# EAGLE schematic ml-rf (EAGLE 5.06)
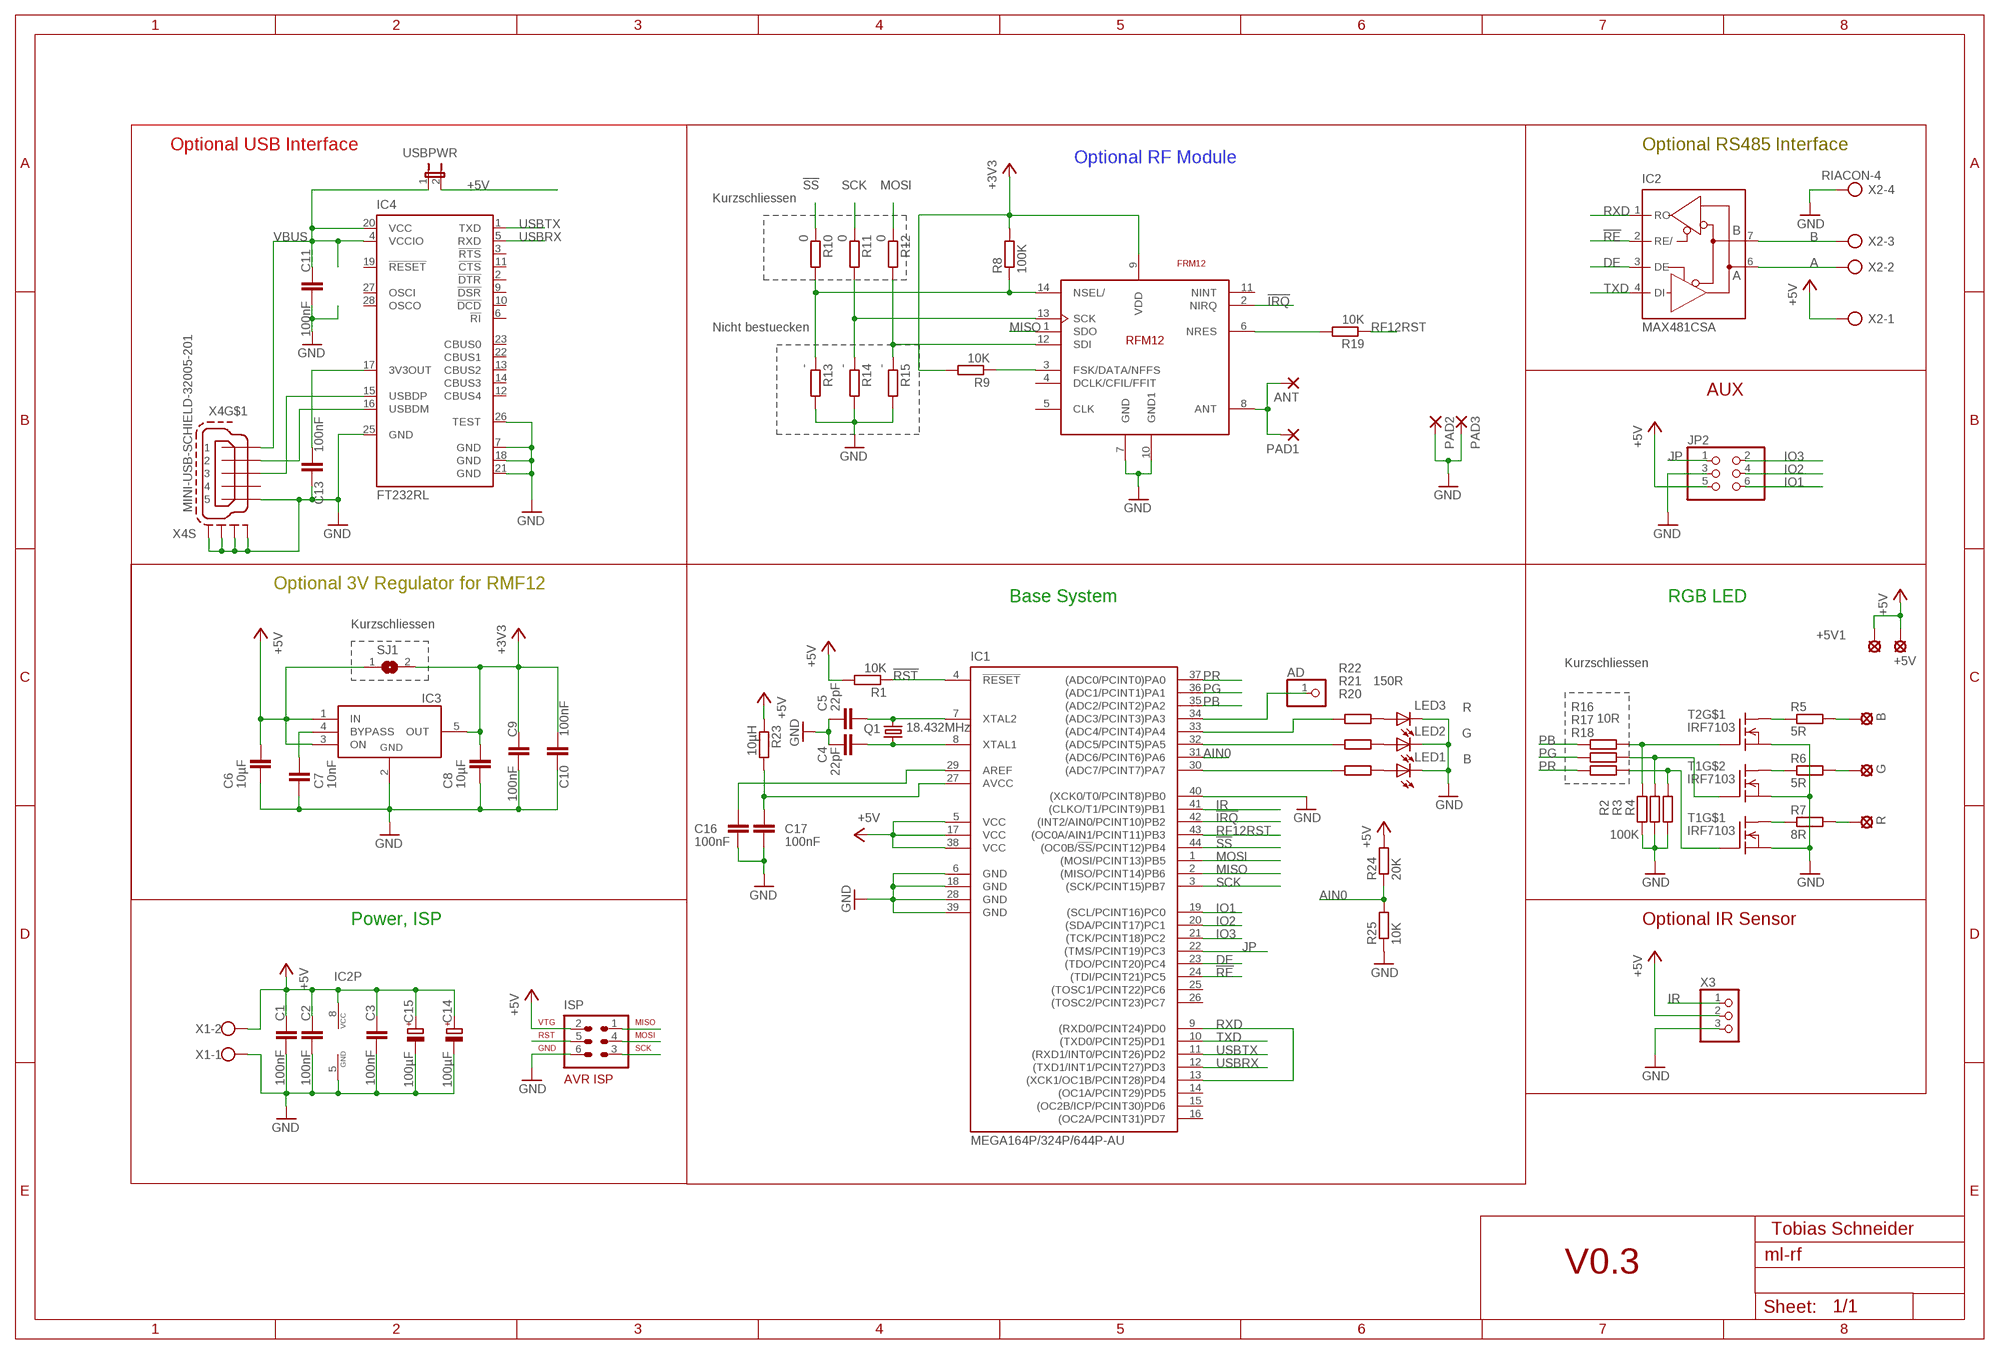
[diagram p0: schematic, sheet 1]

## Parts
+5V  SE14  [SE14]
+5V1  SE14  [SE14]
AD  PINHD-1X1  [1X01]
ANT  2,15/1,0  [2,15/1,0]
B  SE14  [SE14]
C1  100nF  C-EUC0805K  [C0805K]
C2  100nF  C-EUC0805K  [C0805K]
C3  100nF  C-EUC0805K  [C0805K]
C4  22pF  C-EUC0805K  [C0805K]
C5  22pF  C-EUC0805K  [C0805K]
C6  10µF  C-EUC0805K  [C0805K]
C7  10nF  C-EUC0805K  [C0805K]
C8  10µF  C-EUC0805K  [C0805K]
C9  100nF  C-EUC0805K  [C0805K]
C10  100nF  C-EUC0805K  [C0805K]
C11  100nF  C-EUC0805K  [C0805K]
C13  100nF  C-EUC0805K  [C0805K]
C14  100µF  CPOL-EUE2.5-6  [E2,5-6]
C15  100µF  CPOL-EUE2.5-6  [E2,5-6]
C16  100nF  C-EUC0603  [C0603]
C17  100nF  C-EUC0603  [C0603]
G  SE14  [SE14]
IC1  MEGA164P/324P/644P-AU  [TQFP44]
IC2  MAX481CSA  [SO08]
IC3  LP2992-3.3  [SOT-23-5]
IC4  FT232RL  [SSOP28]
ISP  AVR-ISP-6  [AVR-ISP-6]
JP2  PINHD-2X3  [2X03]
LED1  B  LEDCHIP-LED0603  [CHIP-LED0603]
LED2  G  LEDCHIP-LED0603  [CHIP-LED0603]
LED3  R  LEDCHIP-LED0603  [CHIP-LED0603]
PAD1  SMD2  [SMD1,27-2,54]
PAD2  SMD2  [SMD1,27-2,54]
PAD3  SMD2  [SMD1,27-2,54]
Q1  18.432MHz  CRYTALHC49UP  [HC49UP@1]
R  SE14  [SE14]
R1  10K  R-EU_M0805  [M0805]
R2  100K  R-EU_M0805  [M0805]
R3  100K  R-EU_M0805  [M0805]
R4  100K  R-EU_M0805  [M0805]
R5  5R  R-EU_0414/15  [0414/15]
R6  5R  R-EU_0414/15  [0414/15]
R7  8R  R-EU_0414/15  [0414/15]
R8  100K  R-EU_M0805  [M0805]
R9  10K  R-EU_M0805  [M0805]
R10  0  R-EU_M0805  [M0805]
R11  0  R-EU_M0805  [M0805]
R12  0  R-EU_M0805  [M0805]
R13  -  R-EU_M0805  [M0805]
R14  -  R-EU_M0805  [M0805]
R15  -  R-EU_M0805  [M0805]
R16  10R  R-EU_M0805  [M0805]
R17  10R  R-EU_M0805  [M0805]
R18  10R  R-EU_M0805  [M0805]
R19  10K  R-EU_M0805  [M0805]
R20  150R  R-EU_R0603  [R0603]
R21  150R  R-EU_R0603  [R0603]
R22  150R  R-EU_R0603  [R0603]
R23  10µH  R-EU_R0805  [R0805]
R24  20K  R-EU_R0603  [R0603]
R25  10K  R-EU_R0603  [R0603]
RFM12  FRM12  [RFM12]
SJ1  SJ  [SJ]
T1  IRF7103  [SO-8]
T2  IRF7103  [SO-8]
USBPWR  JP1E  [JP1]
X1  W237-102-350  [W237-102-3.5-1.2]
X2  RIACON-4  [RIACON-4]
X3  PINHD-1X3SMALL  [1X03-SMALL]
X4  MINI-USB-SCHIELD-32005-201  [32005-201]

## Nets
!IRQ: IC1.42((INT2/AIN0/PCINT10)PB2) RFM12.2(NIRQ)
!RE: IC1.24((TDI/PCINT21)PC5) IC2.2(RE/)
!RST: IC1.4(!RESET) ISP.5 R1.1
!SS: IC1.44((OC0B/!SS!/PCINT12)PB4) R10.1
+3V3: C8.1 C9.1 C10.2 IC3.5(OUT) R8.2 R9.2 RFM12.9(VDD) SJ1.2
+5V: +5V1.MP +5V.MP C1.1 C2.1 C3.1 C6.1 C14.+ C15.+ IC1.5(VCC) IC1.17(VCC) IC1.38(VCC) IC2.8(VCC) IC3.1(IN) IC3.3(ON) ISP.2 JP2.5 R1.2 R23.1 R24.2 SJ1.1 USBPWR.2 X1.2 X2.1 X3.2
A: IC2.6(A) X2.2
AIN0: IC1.31((ADC6/PCINT6)PA6) R24.1 R25.2
B: IC2.7(B) X2.3
BY: C7.1 IC3.4(BYPASS)
DE: IC1.23((TDO/PCINT20)PC4) IC2.3(DE)
GB: R2.1 R16.1 T2.2(G)
GG: R3.1 R17.1 T1.4(G)
GND: C1.2 C2.2 C3.2 C4.1 C5.1 C6.2 C7.2 C8.2 C9.2 C10.1 C11.2 C13.1 C14.- C15.- C16.1 C17.1 IC1.6(GND) IC1.18(GND) IC1.28(GND) IC1.39(GND) IC1.40((XCK0/T0/PCINT8)PB0) IC2.5(GND) IC3.2(GND) IC4.7(GND) IC4.18(GND) IC4.21(GND) IC4.25(GND) IC4.26(TEST) ISP.6 JP2.3 LED1.C LED2.C LED3.C PAD2.1(P) PAD3.1(P) R2.2 R3.2 R4.2 R13.2 R14.2 R15.2 R25.1 RFM12.7(GND) RFM12.10(GND1) T1.1(S) T1.3(S) T2.1(S) X1.1 X2.4 X3.3 X4.5 X4.M1(S:S1) X4.M2(S:S2) X4.M3(S:S3) X4.M4(S:S4)
GR: R4.1 R18.1 T1.2(G)
IO1: IC1.19((SCL/PCINT16)PC0) JP2.6
IO2: IC1.20((SDA/PCINT17)PC1) JP2.4
IO3: IC1.21((TCK/PCINT18)PC2) JP2.2
IR: IC1.41((CLKO/T1/PCINT9)PB1) X3.1
JP: IC1.22((TMS/PCINT19)PC3) JP2.1
LO1: IC1.30((ADC7/PCINT7)PA7) R20.2
LO2: IC1.32((ADC5/PCINT5)PA5) R21.2
LO3: IC1.33((ADC4/PCINT4)PA4) R22.2
MISO: IC1.2((MISO/PCINT14)PB6) ISP.1 RFM12.1(SDO)
MOSI: IC1.1((MOSI/PCINT13)PB5) ISP.4 R12.1
N$1: R7.1 T1.8(D1)
N$3: R11.2 R14.1 RFM12.13(SCK)
N$4: R6.1 T1.5(D1)
N$5: R5.1 T2.8(D1)
N$6: R12.2 R15.1 RFM12.12(SDI)
N$7: R7.2 R.MP
N$8: G.MP R6.2
N$9: B.MP R5.2
N$10: IC4.16(USBDM) X4.2
N$11: R9.1 RFM12.3(FSK/DATA/NFFS)
N$12: R19.2 RFM12.6(NRES)
N$13: ANT.1(P) PAD1.1(P) RFM12.8(ANT)
N$14: R8.1 R10.2 R13.1 RFM12.14(NSEL/)
N$15: C17.2 IC1.27(AVCC) R23.2
N$16: IC4.15(USBDP) X4.3
N$20: C13.2 IC4.17(3V3OUT)
N$21: LED1.A R20.1
N$22: LED2.A R21.1
N$23: LED3.A R22.1
N$27: AD.1 IC1.34((ADC3/PCINT3)PA3)
N$29: C16.2 IC1.29(AREF)
PB: IC1.35((ADC2/PCINT2)PA2) R16.2
PG: IC1.36((ADC1/PCINT1)PA1) R17.2
PR: IC1.37((ADC0/PCINT0)PA0) R18.2
RF12RST: IC1.43((OC0A/AIN1/PCINT11)PB3) R19.1
RXD: IC1.9((RXD0/PCINT24)PD0) IC1.13((XCK1/OC1B/PCINT28)PD4) IC2.1(RO)
SCK: IC1.3((SCK/PCINT15)PB7) ISP.3 R11.1
TXD: IC1.10((TXD0/PCINT25)PD1) IC2.4(DI)
USBRX: IC1.12((TXD1/INT1/PCINT27)PD3) IC4.5(RXD)
USBTX: IC1.11((RXD1/INT0/PCINT26)PD2) IC4.1(TXD)
VBUS: C11.1 IC4.4(VCCIO) IC4.20(VCC) USBPWR.1 X4.1
XTAL1: C5.2 IC1.7(XTAL2) Q1.2
XTAL2: C4.2 IC1.8(XTAL1) Q1.1
Unconnected: IC1.14((OC1A/PCINT29)PD5) IC1.15((OC2B/ICP/PCINT30)PD6) IC1.16((OC2A/PCINT31)PD7) IC1.25((TOSC1/PCINT22)PC6) IC1.26((TOSC2/PCINT23)PC7) IC4.2(!DTR) IC4.3(!RTS) IC4.6(!RI) IC4.9(!DSR) IC4.10(!DCD) IC4.11(!CTS) IC4.12(CBUS4) IC4.13(CBUS2) IC4.14(CBUS3) IC4.19(!RESET) IC4.22(CBUS1) IC4.23(CBUS0) IC4.27(OSCI) IC4.28(OSCO) RFM12.4(DCLK/CFIL/FFIT) RFM12.5(CLK) RFM12.11(NINT) T1.6(D) T1.7(D) T2.3(S) T2.4(G) T2.5(D1) T2.6(D) T2.7(D) X4.4

## Notes on the sheet
- Optional USB Interface | Optional RS485 Interface
- Optional RF Module
- Kurzschliessen
- Nicht bestuecken
- AUX
- Optional 3V Regulator for RMF12
- Base System | RGB LED
- Kurzschliessen
- Kurzschliessen
- Power, ISP | Optional IR Sensor
- Tobias Schneider
- V0.3

## Library data of the parts
+5V +5V1 B G R = solpad:SE14: SOLDER PAD E1553, drill 1,4mm, distributor Buerklin, 07F820
AD = pinhead:PINHD-1X1: PIN HEADER
ANT = wirepad:2,15/1,0: THROUGH-HOLE PAD
C1-C11 C13 C16 C17 = rcl:C-EU: CAPACITOR, European symbol
C14 C15 = rcl:CPOL-EU: POLARIZED CAPACITOR, European symbol
IC1 = avr-5:MEGA164P/324P/644P-AU
IC2 = maxim:MAX481CSA: RS485 TRANSEIVER
IC3 = regulators:LP2992-*: LP2992-x Micropower 250 mA ultra low-dropout regulator in SOT-23-5 package For use with very low ESR output capacitors
IC4 = ftdichip:FT232R: Source: http://www.ftdichip.com/Documents/DataSheets/DS_FT232R_v104.pdf
ISP = atmel:AVR-ISP-6: AVR ISP-6 Serial Programming Header
JP2 = pinhead:PINHD-2X3: PIN HEADER
LED1-LED3 = led:LED: LED OSRAM: - CHIPLED LG R971, LG N971, LY N971, LG Q971, LY Q971, LO R971, LY R971 LH N974, LH R974 LS Q976, LO Q976, LY Q976 LO Q996 - Hyper CHIPLED LW Q18S LB Q993, LB Q99A, LB R99A - SideLED LS A670, LO A670, LY A670, LG A670, LP A670 LB A673, LV A673, LT A673, LW A673 LH A674 LY A675 LS A676, LA A676, LO A676, LY A676, LW A676 LS A679, LY A679, LG A679 - Hyper Micro SIDELED® LS Y876, LA Y876, LO Y876, LY Y876 LT Y87S - SmartLED LW L88C, LW L88S LB L89C, LB L89S, LG L890 LS L89K, LO L89K, LY L89K LS L896, LA L896, LO L896, LY L896 - TOPLED LS T670, LO T670, LY T670, LG T670, LP T670 LSG T670, LSP T670, LSY T670, LOP T670, LYG T670 LG T671, LOG T671, LSG T671 LB T673, LV T673, LT T673, LW T673 LH T674 LS T676, LA T676, LO T676, LY T676, LB T676, LH T676, LSB T676, LW T676 LB T67C, LV T67C, LT T67C, LS T67K, LO T67K, LY T67K, LW E67C LS E67B, LA E67B, LO E67B, LY E67B, LB E67C, LV E67C, LT E67C LW T67C LS T679, LY T679, LG T679 LS T770, LO T770, LY T770, LG T770, LP T770 LB T773, LV T773, LT T773, LW T773 LH T774 LS E675, LA E675, LY E675, LS T675 LS T776, LA T776, LO T776, LY T776, LB T776 LHGB T686 LT T68C, LB T68C - Hyper Mini TOPLED® LB M676 - Mini TOPLED Santana® LG M470 LS M47K, LO M47K, LY M47K Source: http://www.osram.convergy.de LUXEON: - LUMILED® LXK2-PW12-R00, LXK2-PW12-S00, LXK2-PW14-U00, LXK2-PW14-V00 LXK2-PM12-R00, LXK2-PM12-S00, LXK2-PM14-U00 LXK2-PE12-Q00, LXK2-PE12-R00, LXK2-PE12-S00, LXK2-PE14-T00, LXK2-PE14-U00 LXK2-PB12-K00, LXK2-PB12-L00, LXK2-PB12-M00, LXK2-PB14-N00, LXK2-PB14-P00, LXK2-PB14-Q00 LXK2-PR12-L00, LXK2-PR12-M00, LXK2-PR14-Q00, LXK2-PR14-R00 LXK2-PD12-Q00, LXK2-PD12-R00, LXK2-PD12-S00 LXK2-PH12-R00, LXK2-PH12-S00 LXK2-PL12-P00, LXK2-PL12-Q00, LXK2-PL12-R00 Source: www.luxeon.com KINGBRIGHT: KA-3528ASYC Source: www.kingbright.com
PAD1-PAD3 = wirepad:SMD2: SMD PAD
Q1 = crystal:CRYTAL: CRYSTAL
R1-R4 R8-R25 = rcl:R-EU_: RESISTOR, European symbol
R5-R7 = rclml:R-EU_: RESISTOR, European symbol
RFM12 = RFM12:FRM12
SJ1 = jumper:SJ: SMD solder JUMPER
T1 T2 = transistor-fet+irf7201:IRF7103
USBPWR = jumper:JP1E: JUMPER
X1 = clamps:W237-102: WAGO SCREW CLAMP
X2 = con-riacon:RIACON-4
X3 = pinhead-3small:PINHD-1X3: PIN HEADER
X4 = con-cypressindustries:MINI-USB-SCHIELD-: MINI USB-B Conector Source: www.cypressindustries.com